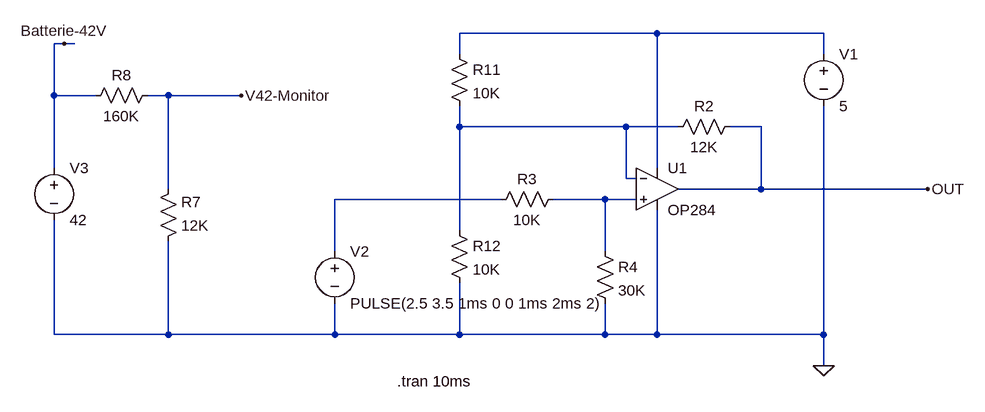
[diagram p0: schematic Current_OP.asc]
Current_OP.asc, the LTspice schematic file:
Version 4
SHEET 1 880 680
WIRE 192 -96 -112 -96
WIRE 448 -96 192 -96
WIRE -720 -80 -736 -80
WIRE -704 -80 -720 -80
WIRE -112 -64 -112 -96
WIRE 448 -64 448 -96
WIRE -736 0 -736 -80
WIRE -672 0 -736 0
WIRE -560 0 -592 0
WIRE -448 0 -560 0
WIRE -112 48 -112 16
WIRE 144 48 -112 48
WIRE 224 48 144 48
WIRE 352 48 304 48
WIRE -736 112 -736 0
WIRE 192 112 192 -96
WIRE 144 128 144 48
WIRE 160 128 144 128
WIRE -560 144 -560 0
WIRE 352 144 352 48
WIRE 352 144 224 144
WIRE 608 144 352 144
WIRE -48 160 -304 160
WIRE 112 160 32 160
WIRE 160 160 112 160
WIRE -112 208 -112 48
WIRE -304 240 -304 160
WIRE 112 240 112 160
WIRE -736 368 -736 192
WIRE -560 368 -560 224
WIRE -560 368 -736 368
WIRE -304 368 -304 320
WIRE -304 368 -560 368
WIRE -112 368 -112 288
WIRE -112 368 -304 368
WIRE 112 368 112 320
WIRE 112 368 -112 368
WIRE 192 368 192 176
WIRE 192 368 112 368
WIRE 448 368 448 16
WIRE 448 368 192 368
WIRE 448 416 448 368
FLAG 448 416 0
FLAG 608 144 OUT
FLAG -720 -80 Batterie-42V
FLAG -448 0 V42-Monitor
SYMBOL OpAmps\\OP284 192 80 R0
SYMATTR InstName U1
SYMBOL voltage 448 -80 R0
WINDOW 123 0 0 Left 0
WINDOW 39 0 0 Left 0
SYMATTR InstName V1
SYMATTR Value 5
SYMBOL res 320 32 R90
WINDOW 0 0 56 VBottom 2
WINDOW 3 32 56 VTop 2
SYMATTR InstName R2
SYMATTR Value 12K
SYMBOL res 48 144 R90
WINDOW 0 0 56 VBottom 2
WINDOW 3 32 56 VTop 2
SYMATTR InstName R3
SYMATTR Value 10K
SYMBOL res 96 224 R0
SYMATTR InstName R4
SYMATTR Value 30K
SYMBOL voltage -304 224 R0
WINDOW 123 0 0 Left 0
WINDOW 39 0 0 Left 0
SYMATTR InstName V2
SYMATTR Value PULSE(2.5 3.5 1ms 0 0 1ms 2ms 2)
SYMBOL res -128 -80 R0
SYMATTR InstName R11
SYMATTR Value 10K
SYMBOL res -128 192 R0
SYMATTR InstName R12
SYMATTR Value 10K
SYMBOL voltage -736 96 R0
WINDOW 123 0 0 Left 0
WINDOW 39 0 0 Left 0
SYMATTR InstName V3
SYMATTR Value 42
SYMBOL res -576 -16 R90
WINDOW 0 0 56 VBottom 2
WINDOW 3 32 56 VTop 2
SYMATTR InstName R8
SYMATTR Value 160K
SYMBOL res -576 240 M180
WINDOW 0 36 76 Left 2
WINDOW 3 36 40 Left 2
SYMATTR InstName R7
SYMATTR Value 12K
TEXT -208 440 Left 2 !.tran 10ms

The netlist it stands for:
* Current_OP.asc
XU1 N004 N002 N001 0 OUT OP284  ; pins In+ In- V+ V- OUT
V1 N001 0 5
R2 OUT N002 12K
R3 N004 N003 10K
R4 N004 0 30K
V2 N003 0 PULSE(2.5 3.5 1ms 0 0 1ms 2ms 2)
R11 N001 N002 10K
R12 N002 0 10K
V3 Batterie-42V 0 42
R8 V42-Monitor Batterie-42V 160K
R7 0 V42-Monitor 12K
.tran 10ms
.lib ADI1.lib
.backanno
.end